# Altium schematic sheet Bitcoiner_EB_Project_V1I1_Schematic.SchDoc: Bitcoiner Expansion Board (part 3 of 3)
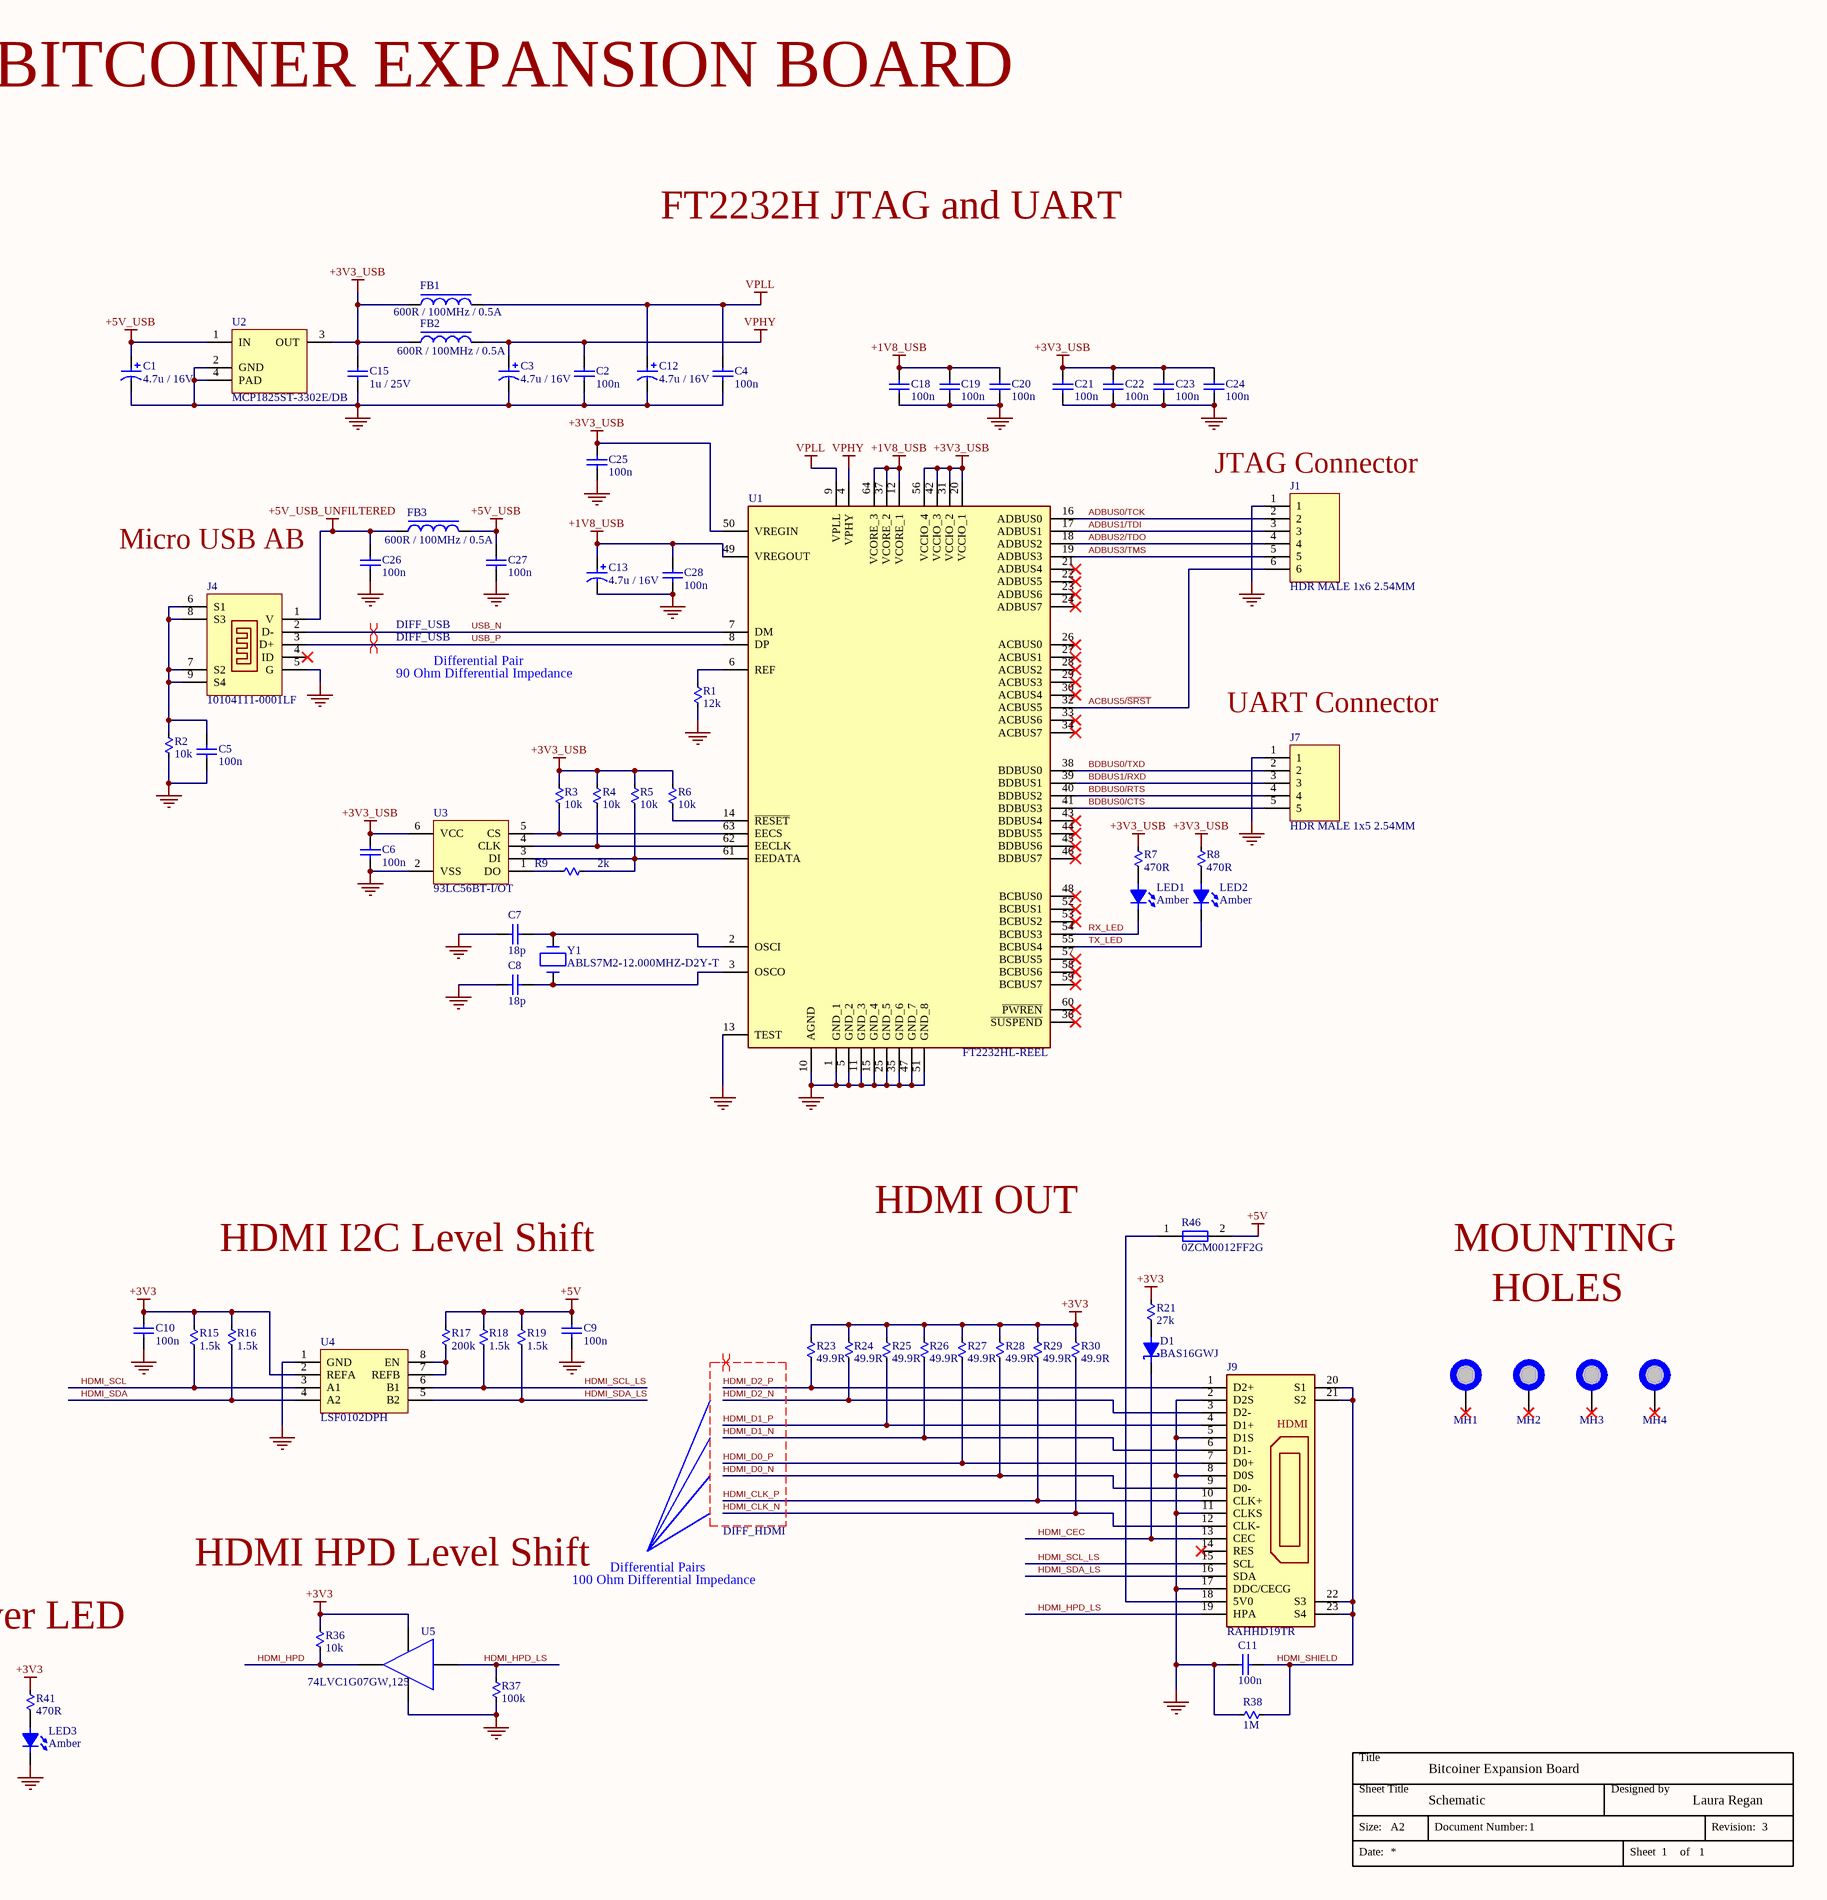
[diagram p3: Bitcoiner_EB_Project_V1I1_Schematic.SchDoc, right]

## Library data of the parts (continued)
R42 = CR0805-FX-5232ELF: Res Thick Film 0805 52.3K Ohm 1% 1/8W ±100ppm/°C Molded SMD SMD Paper Tape on Plastic Reel; Manufacturer: Bourns; Resistance: 52.3kR; Power Rating: 125mW; Voltage Rating: 150V; Supplier 1: Mouser; Manufacturer Part Number: CR0805-FX-5232ELF; RoHS: Yes; Category: Chip SMD Resistors; Stock 1: 18366; Pricing 1: 1=0.10000, 10=0.02400, 50=0.02400, 100=0.01400, 1000=0.00800, 10000=0.00400 (USD); Mount: Surface Mount; Case/Package: 0805; Contact Plating: Tin; Case Code (Imperial): 0805; Case Code (Metric): 2012; Min Operating Temperature: -55°C; Max Operating Temperature: 155°C; Tolerance: 1%; Resistor Type: Thick Film; Temperature Coefficient: 100ppm/°C; Packaging: Tape and Reel; Package Quantity: 5000; Termination: SMD/SMT; Features: Moisture Resistant; Series: CR0805; Max Power Dissipation: 125mW; Number of Terminations: 2; Construction: Rectangular; Length: 2mm; Width: 1.25mm; Height: 0.5mm; Depth: 1.25mm; Thickness: 508um; Radiation Hardening: No; Military Standard: Not; RoHS Compliant: Yes; ComponentLink1URL: https://datasheet.ciiva.com/16926/chpreztr-16926583.pdf?src-supplier=Avnet+Europe; ComponentLink1Description: https://datasheet.ciiva.com/16926/chpreztr-16926583.pdf?src-supplier=Avnet+Europe; ComponentLink2URL: https://datasheet.ciiva.com/9121/chpreztr-9121194.pdf?src-supplier=Avnet; ComponentLink2Description: https://datasheet.ciiva.com/9121/chpreztr-9121194.pdf?src-supplier=Avnet; ComponentLink3URL: https://datasheet.ciiva.com/5574/chpreztr-5574347.pdf?src-supplier=Mouser; ComponentLink3Description: https://datasheet.ciiva.com/5574/chpreztr-5574347.pdf?src-supplier=Mouser; Supplier Part Number 1: 652-CR0805FX-5232ELF
R44 R45 = RC0805FR-070RL: Res Thick Film 0805 0 Ohm Epoxy Pad SMD T/R; Manufacturer: Yageo; Resistance: 0mR; Tolerance: 1%; Power Rating: 125mW; Supplier 1: Mouser; Manufacturer Part Number: RC0805FR-070RL; RoHS: Yes; Category: Chip SMD Resistors; Stock 1: 32082; Pricing 1: 1=0.10000, 10=0.03400, 50=0.03400, 100=0.01300, 1000=0.00700, 10000=0.00400 (USD); Case/Package: 0805; Contact Plating: Tin,Matte; Case Code (Imperial): 0805; Case Code (Metric): 2012; Size Code: 0805; Min Operating Temperature: -55°C; Max Operating Temperature: 155°C; Resistor Type: Thick Film; Packaging: Tape and Reel; Features: Moisture Resistant; Series: RC; Max Power Dissipation: 125mW; Number of Terminations: 2; Construction: Rectangular; Length: 2mm; Depth: 1.25mm; Radiation Hardening: No; Military Standard: Not; Lead Free: Lead Free; RoHS Compliant: Yes; ComponentLink1URL: https://datasheet.ciiva.com/17042/rc0805-17042698.pdf?src-supplier=Future+Electronics; ComponentLink1Description: https://datasheet.ciiva.com/17042/rc0805-17042698.pdf?src-supplier=Future+Electronics; ComponentLink2URL: https://datasheet.ciiva.com/15189/getdatasheetpartid-348154-15189885.pdf?src-supplier=Verical; ComponentLink2Description: https://datasheet.ciiva.com/15189/getdatasheetpartid-348154-15189885.pdf?src-supplier=Verical; Supplier Part Number 1: 603-RC0805FR-070RL
R46 = 0ZCM0012FF2G: PTC RESET FUSE 9V 120MA 0603; Manufacturer: Bel; Max Current Rating: 40A; Trip Current: 300mA; Time to Trip: 0.1s; Supplier 1: Mouser; Manufacturer Part Number: 0ZCM0012FF2G; RoHS: Yes; Category: PTC Resettable Fuses; Stock 1: 3742; Pricing 1: 1=0.13000, 10=0.11800, 50=0.11800, 100=0.08400, 1000=0.06100, 10000=0.05000 (USD); Case/Package: 0603; Case Code (Metric): 1608; Case Code (Imperial): 0603; Package Quantity: 1; Packaging: Tape and Reel; Hold Current: 120mA; RoHS Compliant: Yes; ComponentLink1URL: https://datasheet.ciiva.com/18550/0zcm-18550763.pdf?src-supplier=Digi-Key; ComponentLink1Description: https://datasheet.ciiva.com/18550/0zcm-18550763.pdf?src-supplier=Digi-Key; ComponentLink2URL: https://datasheet.ciiva.com/18550/0zcm-18550764.pdf?src-supplier=Digi-Key; ComponentLink2Description: https://datasheet.ciiva.com/18550/0zcm-18550764.pdf?src-supplier=Digi-Key; ComponentLink3URL: https://datasheet.ciiva.com/18550/0zcm-18550765.pdf?src-supplier=Digi-Key; ComponentLink3Description: https://datasheet.ciiva.com/18550/0zcm-18550765.pdf?src-supplier=Digi-Key; Supplier Part Number 1: 530-0ZCM0012FF2G
R47-R62 = ERJ-3EKF2000V: RES SMD 200 OHM 1% 1/10W 0603; Manufacturer: Panasonic; Temperature Coefficient: 100ppm/°C; Voltage Rating (DC): 50V; Power Rating: 100mW; Voltage Rating: 75V; Supplier 1: Mouser; Manufacturer Part Number: ERJ-3EKF2000V; RoHS: Yes; Category: Chip SMD Resistors; Stock 1: 1081429; Pricing 1: 1=0.1, 10=0.049, 50=0.049, 100=0.02, 1000=0.009, 10000=0.005 (USD); Mount: Surface Mount; Case/Package: 0603; Case Code (Metric): 1608; Case Code (Imperial): 0603; Min Operating Temperature: -55°C; Max Operating Temperature: 155°C; Tolerance: 1%; Resistance: 200R; Packaging: Tape and Reel; Resistor Type: Thick Film; Package Quantity: 1; Number of Terminations: 2; Termination: SMD/SMT; Max Power Dissipation: 100mW; Features: Automotive AEC-Q200; Series: ERJ; Construction: Rectangular; Length: 1.6mm; Width: 0.8mm; Height: 0.022inch; Depth: 0.8mm; Lead Free: Lead Free; Military Standard: Not; RoHS Compliant: Yes; Supplier Part Number 1: 667-ERJ-3EKF2000V; Contact Plating: Tin; Resistance Tolerance: 1%; Technology: THICK FILM; Working Voltage: 75V; Radiation Hardening: No; Reach SVHC Compliant: No
SW1-SW4 = OS102011MS2QN1: Slide; Manufacturer: ITT C&K; Mechanical Life: 10000Cycles; Actuator Material: Polyoxymethylene,Acetal,Polyacetal; Actuator Color: Black; Throw Configuration: SPDT; Max Voltage Rating (DC): 12V; Max Current Rating: 100mA; Contact Resistance: 20mR; Contact Style: Non-Shorting; Insulation Resistance: 100MR; Switch Travel: 2mm; Switch Function: On-On; Actuator Type: Standard; Actuator Length: 4mm; Supplier 1: Mouser; Manufacturer Part Number: OS102011MS2QN1; RoHS: Yes; Category: Slide Switches; Stock 1: 6258; Pricing 1: 1=0.39000, 10=0.39000, 50=0.34400, 100=0.32100, 1000=0.26400, 10000=0.24300 (USD); Mount: Through Hole,PCB; Contact Material: Copper Alloy,Brass,Silver; Contact Plating: Silver,Gold; Housing Material: Resin; Min Operating Temperature: -30°C; Max Operating Temperature: 70°C; Termination: PC Pins; Packaging: Bulk; Electrical Life: 10000Cycles; Orientation: Vertical; Voltage Rating (DC): 12V; Package Quantity: 300; Contact Current Rating: 100mA; Current Rating: 100mA; Series: OS; Length: 8.6mm; Depth: 4.3mm; Radiation Hardening: No; REACH SVHC: No SVHC; RoHS Compliant: Yes; Lead Free: Lead Free; ComponentLink1URL: https://datasheet.ciiva.com/16298/os102011ms2qn1-16298526.pdf?src-supplier=Future+Electronics; ComponentLink1Description: https://datasheet.ciiva.com/16298/os102011ms2qn1-16298526.pdf?src-supplier=Future+Electronics; ComponentLink2URL: https://datasheet.ciiva.com/30466/0900766b81263f61-30466806.pdf?src-supplier=RSComponents; ComponentLink2Description: https://datasheet.ciiva.com/30466/0900766b81263f61-30466806.pdf?src-supplier=RSComponents; ComponentLink3URL: https://datasheet.ciiva.com/1532/1683358-1532308.pdf?src-supplier=Element14; ComponentLink3Description: https://datasheet.ciiva.com/1532/1683358-1532308.pdf?src-supplier=Element14; ComponentLink4URL: https://datasheet.ciiva.com/2889/os-19jan15-2889173.pdf?src-supplier=Digi-Key; ComponentLink4Description: https://datasheet.ciiva.com/2889/os-19jan15-2889173.pdf?src-supplier=Digi-Key; ComponentLink5URL: https://datasheet.ciiva.com/1699/os-19jan15-1699479.pdf?src-supplier=Newark; ComponentLink5Description: https://datasheet.ciiva.com/1699/os-19jan15-1699479.pdf?src-supplier=Newark; ComponentLink6URL: https://datasheet.ciiva.com/18147/getdatasheetpartid-320490-18147210.pdf?src-supplier=Verical; ComponentLink6Description: https://datasheet.ciiva.com/18147/getdatasheetpartid-320490-18147210.pdf?src-supplier=Verical; ComponentLink7URL: https://datasheet.ciiva.com/16997/70128245-16997771.pdf?src-supplier=Allied+Electronics; ComponentLink7Description: https://datasheet.ciiva.com/16997/70128245-16997771.pdf?src-supplier=Allied+Electronics; ComponentLink8URL: https://datasheet.ciiva.com/26290/os-11mar13-26290652.pdf?src-supplier=Onlinecomponents.com; ComponentLink8Description: https://datasheet.ciiva.com/26290/os-11mar13-26290652.pdf?src-supplier=Onlinecomponents.com; Supplier Part Number 1: 611-OS102011MS2QN1
U1 = FT2232HL-REEL: Integrated Circuit; Manufacturer: FTDI Chip; Datasheet Link: https://componentsearchengine.com//FT2232HL-REEL.pdf; Height: 1.6mm; Mouser2 Part Number: 895-FT2232HL; Mouser2 Price/Stock: https://www.mouser.com/Search/Refine.aspx?Keyword=895-FT2232HL; Manufacturer Part Number: FT2232HL-REEL
U2 U7 = MCP1825ST-3302E/DB: IC REG LIN 3.3V 500MA SOT223-3; Manufacturer: Microchip; Number of Outputs: 1; Min Input Voltage: 2.1V; Dropout Voltage: 210mV; Max Input Voltage: 6V; Input Bias Current: 120uA; Polarity: Positive; Quiescent Current: 220uA; Output Voltage Accuracy: 0.5%; Output Type: Fixed; Supplier 1: Mouser; Manufacturer Part Number: MCP1825ST-3302E/DB; RoHS: Yes; Category: Voltage Regulators - Linear; Stock 1: 7744; Pricing 1: 1=0.57000, 10=0.56700, 50=0.47300, 100=0.43100, 1000=0.43100, 10000=0.43000 (USD); Mount: Surface Mount; Case/Package: SOT-223; Number of Pins: 3; Min Operating Temperature: -40°C; Max Operating Temperature: 125°C; Output Voltage: 3.3V; Packaging: Tape and Reel; Package Quantity: 4000; Output Current: 500mA; Number of Regulators: 1; Series: -; Radiation Hardening: No; RoHS Compliant: Yes; ComponentLink1URL: https://datasheet.ciiva.com/8238/22056b-8238778.pdf?src-supplier=Avnet; ComponentLink1Description: https://datasheet.ciiva.com/8238/22056b-8238778.pdf?src-supplier=Avnet; ComponentLink2URL: https://datasheet.ciiva.com/2056/22056b-2056427.pdf?src-supplier=Digi-Key; ComponentLink2Description: https://datasheet.ciiva.com/2056/22056b-2056427.pdf?src-supplier=Digi-Key; Supplier Part Number 1: 579-MCP1825ST3302EDB
U3 = 93LC56BT-I/OT: MICROCHIP - 93LC56BT-I/OT. - 2K, 128 X 16, SERIAL EE, IND ROHS COMPLIANT: YES; Density: 2Kb; Max Supply Voltage: 5.5V; Min Supply Voltage: 2.5V; Access Time: 250ns; Frequency: 2MHz; Nominal Supply Current: 2mA; Memory Type: EEPROM; Supplier 1: Mouser; Manufacturer: Microchip; Manufacturer Part Number: 93LC56BT-I/OT; RoHS: No; Category: EEPROM; Stock 1: 38253; Pricing 1: 1=0.25000, 10=0.24200, 50=0.23100, 100=0.22100, 1000=0.22100, 10000=0.22100 (USD); Mount: Surface Mount; Case/Package: SOT-23; Number of Pins: 6; Contact Plating: Tin,Matte; Min Operating Temperature: -40°C; Max Operating Temperature: 85°C; Packaging: Tape and Reel; Package Quantity: 3000; Interface: Serial; Memory Size: 2Kb; Max Frequency: 2MHz; Length: 3.1mm; Width: 1.8mm; Height: 1.3mm; Radiation Hardening: No; REACH SVHC: No SVHC; Lead Free: Lead Free; ComponentLink1URL: https://datasheet.ciiva.com/48496/jp013939-48496476.pdf?src-supplier=Avnet; ComponentLink1Description: https://datasheet.ciiva.com/48496/jp013939-48496476.pdf?src-supplier=Avnet; ComponentLink2URL: https://datasheet.ciiva.com/16216/filehandler-aspxddocname-en013939-16216574.pdf?src-supplier=Future+Electronics; ComponentLink2Description: https://datasheet.ciiva.com/16216/filehandler-aspxddocname-en013939-16216574.pdf?src-supplier=Future+Electronics; ComponentLink3URL: https://datasheet.ciiva.com/3185/jp013939-3185519.pdf?src-supplier=Avnet; ComponentLink3Description: https://datasheet.ciiva.com/3185/jp013939-3185519.pdf?src-supplier=Avnet; ComponentLink4URL: https://datasheet.ciiva.com/16622/jp013939-16622127.pdf?src-supplier=Avnet+Europe; ComponentLink4Description: https://datasheet.ciiva.com/16622/jp013939-16622127.pdf?src-supplier=Avnet+Europe; Supplier Part Number 1: 579-93LC56BT-I/OT
U4 = LSF0102DPH: Manufacturer: Nexperia; Supplier 1: Mouser; Manufacturer Part Number: LSF0102DPH; RoHS: No; Stock 1: 2386; Pricing 1: 1=0.58000, 10=0.48100, 50=0.48100, 100=0.36500, 1000=0.24800, 10000=0.20100 (USD); Supplier Part Number 1: 771-LSF0102DPH
U5 = 74LVC1G07GW,125: NEXPERIA - 74LVC1G07GW,125 - BUFFER, NON-INVERTING, TSSOP-5; Supplier 1: Mouser; Manufacturer: Nexperia; Manufacturer Part Number: 74LVC1G07GW,125; RoHS: Yes; Category: Logic Gates; Stock 1: 3142; Pricing 1: 1=0.24000, 10=0.16400, 50=0.16400, 100=0.08100, 1000=0.04700, 10000=0.03600 (USD); RoHS Compliant: Yes; ComponentLink1URL: http://www.farnell.com/datasheets/2185287.pdf?src-supplier=Farnell; ComponentLink1Description: http://www.farnell.com/datasheets/2185287.pdf?src-supplier=Farnell; ComponentLink2URL: https://assets.nexperia.com/documents/data-sheet/74LVC1G07.pdf?src-supplier=Digi-Key; ComponentLink2Description: https://assets.nexperia.com/documents/data-sheet/74LVC1G07.pdf?src-supplier=Digi-Key; ComponentLink3URL: http://www.farnell.com/datasheets/2185287.pdf?src-supplier=Newark; ComponentLink3Description: http://www.farnell.com/datasheets/2185287.pdf?src-supplier=Newark; Supplier Part Number 1: 771-74LVC1G07GW-G
U6 = TPS562202SDRLR: Manufacturer: Texas Instruments; Supplier 1: Mouser; Manufacturer Part Number: TPS562202SDRLR; RoHS: Yes; Stock 1: 1059; Pricing 1: 1=0.62000, 10=0.54600, 50=0.54600, 100=0.41900, 1000=0.26500, 10000=0.21800 (USD); Supplier Part Number 1: 595-TPS562202SDRLR
Y1 = ABLS7M2-12.000MHZ-D-2Y-T: CRYSTAL 12.0000MHZ 18PF SMD; Manufacturer: Abracon; Frequency Tolerance: 20ppm; Frequency: 12MHz; ESR (Equivalent Series Resistance): 60R; Frequency Stability: 30ppm; Supplier 1: Mouser; Manufacturer Part Number: ABLS7M2-12.000MHZ-D-2Y-T; RoHS: Yes; Category: Crystals; Stock 1: 6312; Pricing 1: 1=0.37000, 10=0.31100, 50=0.27900, 100=0.24800, 1000=0.18900, 10000=0.18900 (USD); Mount: Surface Mount; Case/Package: SMD/SMT; Min Operating Temperature: -40°C; Max Operating Temperature: 85°C; Package Quantity: 3000; Tolerance: 20ppm; Packaging: Tape and Reel; Load Capacitance: 18pF; Termination: SMD/SMT; Length: 0.276inch; Width: 0.161inch; Height: 0.079inch; Lead Free: Lead Free; REACH SVHC: Yes; ComponentLink1URL: http://www.farnell.com/datasheets/2608288.pdf?src-supplier=Farnell; ComponentLink1Description: http://www.farnell.com/datasheets/2608288.pdf?src-supplier=Farnell; ComponentLink2URL: http://www.mouser.com/ds/2/3/ABLS7M2-1003668.pdf?src-supplier=Mouser; ComponentLink2Description: http://www.mouser.com/ds/2/3/ABLS7M2-1003668.pdf?src-supplier=Mouser; ComponentLink3URL: http://www.farnell.com/datasheets/1883657.pdf?src-supplier=Element14; ComponentLink3Description: http://www.farnell.com/datasheets/1883657.pdf?src-supplier=Element14; ComponentLink4URL: http://abracon.com/Resonators/ABLS7M2.pdf?src-supplier=Digi-Key; ComponentLink4Description: http://abracon.com/Resonators/ABLS7M2.pdf?src-supplier=Digi-Key; ComponentLink5URL: https://abracon.com/Resonators/ABLS7M2.pdf?src-supplier=Digi-Key; ComponentLink5Description: https://abracon.com/Resonators/ABLS7M2.pdf?src-supplier=Digi-Key; Supplier Part Number 1: 815-ABLS7M212MHZD2YT
J3 J6 J8 = CON_2X10_2.0MM_RA: Supplier: Aliexpress